# EAGLE design attiny13breadhead (EAGLE 6.1)
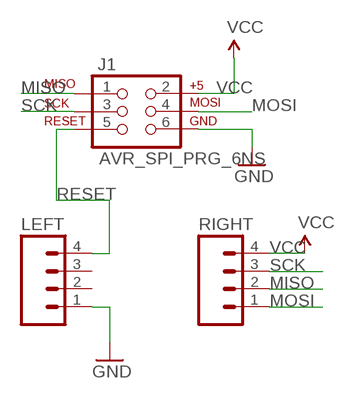
[diagram p0: schematic, sheet 1]

## Parts
J1  AVR_SPI_PRG_6NS  [2X3-NS]
LEFT  M04PTH  [1X04]
RIGHT  M04PTH  [1X04]

## Nets
GND: J1.6 LEFT.1
MISO: J1.1 RIGHT.2
MOSI: J1.4 RIGHT.1
RESET: J1.5 LEFT.4
SCK: J1.3 RIGHT.3
VCC: J1.2 RIGHT.4
Unconnected: LEFT.2 LEFT.3

## Library data of the parts
J1 = SparkFun:AVR_SPI_PRG_6: AVR ISP 6 Pin This is the reduced ISP connector for AVR programming. Common on Arduino. This footprint will take up less PCB space and can be used with a 10-pin to 6-pin adapter such as SKU: BOB-08508
LEFT RIGHT = SparkFun:M04: Header 4 Standard 4-pin 0.1" header. Use with straight break away headers (SKU : PRT-00116), right angle break away headers (PRT-00553), swiss pins (PRT-00743), machine pins (PRT-00117), and female headers (PRT-00115). Molex polarized connector foot print use with SKU : PRT-08231 with associated crimp pins and housings. 1MM SMD Version SKU: PRT-10208

## Board
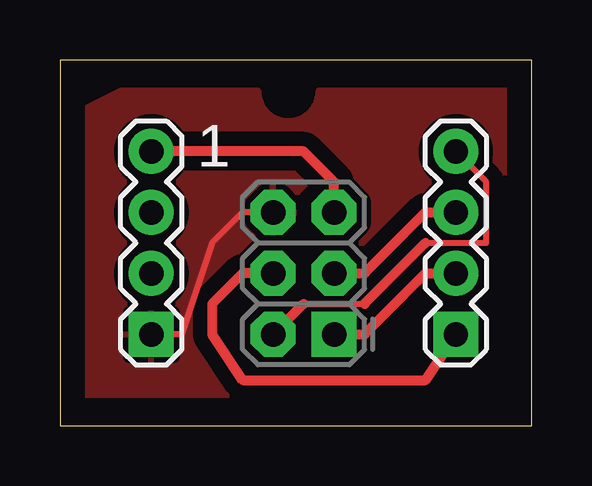
[diagram p1: board, top side]

Size 19.69 x 15.24 mm. Coordinates in mm from the lower left corner, seen from the top.
Outline: 0,0 19.69,0 19.69,15.24 0,15.24 0,0
Copper layers (1*16): Top 0.035mm / dielectric 1.5mm / Bottom 0.035mm
Design rules: minimum track width 10mil, minimum drill 24mil, track to track 8mil, track to pad 8mil, pad to pad 8mil, via to via 8mil, smd to smd 8mil, copper to edge 40mil, drill to drill 8mil, minimum pad ring 10mil, minimum via ring 8mil, stop-mask expansion 4mil, vias tented up to drill 0mil, thermal gap 10mil

### Footprints (pad centres in the part's own frame; a part is rotated, then mirrored left to right if it is on the bottom)
2X3-NS = drill 1.016 pad 1.88 square: 1 -2.54,-1.27 | drill 1.016 pad 1.88 octagon: 2 -2.54,1.27; 3 0,-1.27; 4 0,1.27; 5 2.54,-1.27; 6 2.54,1.27
1X04 = drill 1.016 pad 1.88 square: 1 0,0 | drill 1.016 pad 1.88: 2 2.54,0; 3 5.08,0; 4 7.62,0

### Placement (x,y rotation side)
J1  10.16,6.35 90 top
LEFT  3.81,3.81 90 top
RIGHT  16.51,3.81 90 top

### Tracks (layer width: path | path; a pad name or v marks a point on that pad's centre or on a via)
GND
  Top 0.254: J1.6 7.62,8.89 6.35,7.62 5.08,3.81 LEFT.1
  pour Top (isolate 0.61): 8.25,13.97 arc90 9.52,12.7 arc90 10.8,13.97 19.05,13.97 19.05,1.27 0,1.27 0,12.7 2.54,13.97
MISO
  Top 0.406: J1.1 12.7,3.81 15.24,6.35 RIGHT.2
MOSI
  Top 0.406: J1.4 7.62,6.35 6.35,5.08 6.35,3.81 7.62,1.91 15.24,1.91 RIGHT.1
RESET
  Top 0.406: J1.5 11.43,10.16 10.16,11.43 LEFT.4
SCK
  Top 0.406: J1.3 12.7,6.35 15.24,8.89 RIGHT.3
VCC
  Top 0.254: 10.16,5.08 12.7,5.08 | 15.24,7.62 17.78,7.62 17.78,10.16 RIGHT.4
  Top 0.406: J1.2 10.16,5.08 | 12.7,5.08 15.24,7.62

### Text on the board
tNames: 1